# Altium schematic sheet CAN.SchDoc: Evaluation Board 3.2
size A3; Organization: Toradex AG; Address1: Altsagenstrasse 5; Address2: Horw; Address3: 6048; Address4: Switzerland; DocumentNumber: 19; Revision: V3.2; SheetNumber: 19; SheetTotal: 23; PageSetup: Record=PageOptions|CenterHorizontal=True|CenterVertical=True|PrintScale=0.73|XCorrection=1.00|YCorrection=1.00|PrintKind=0|BorderSize=5000000|LeftOffset=0|BottomOffset=0|Orientation=2|PaperLength=1000|PaperWidth=1000|Scale=100|PaperSource=7|PrintQuality=-4|MediaType=1|DitherType=10|PaperKind=A4|PrintScaleMode=1
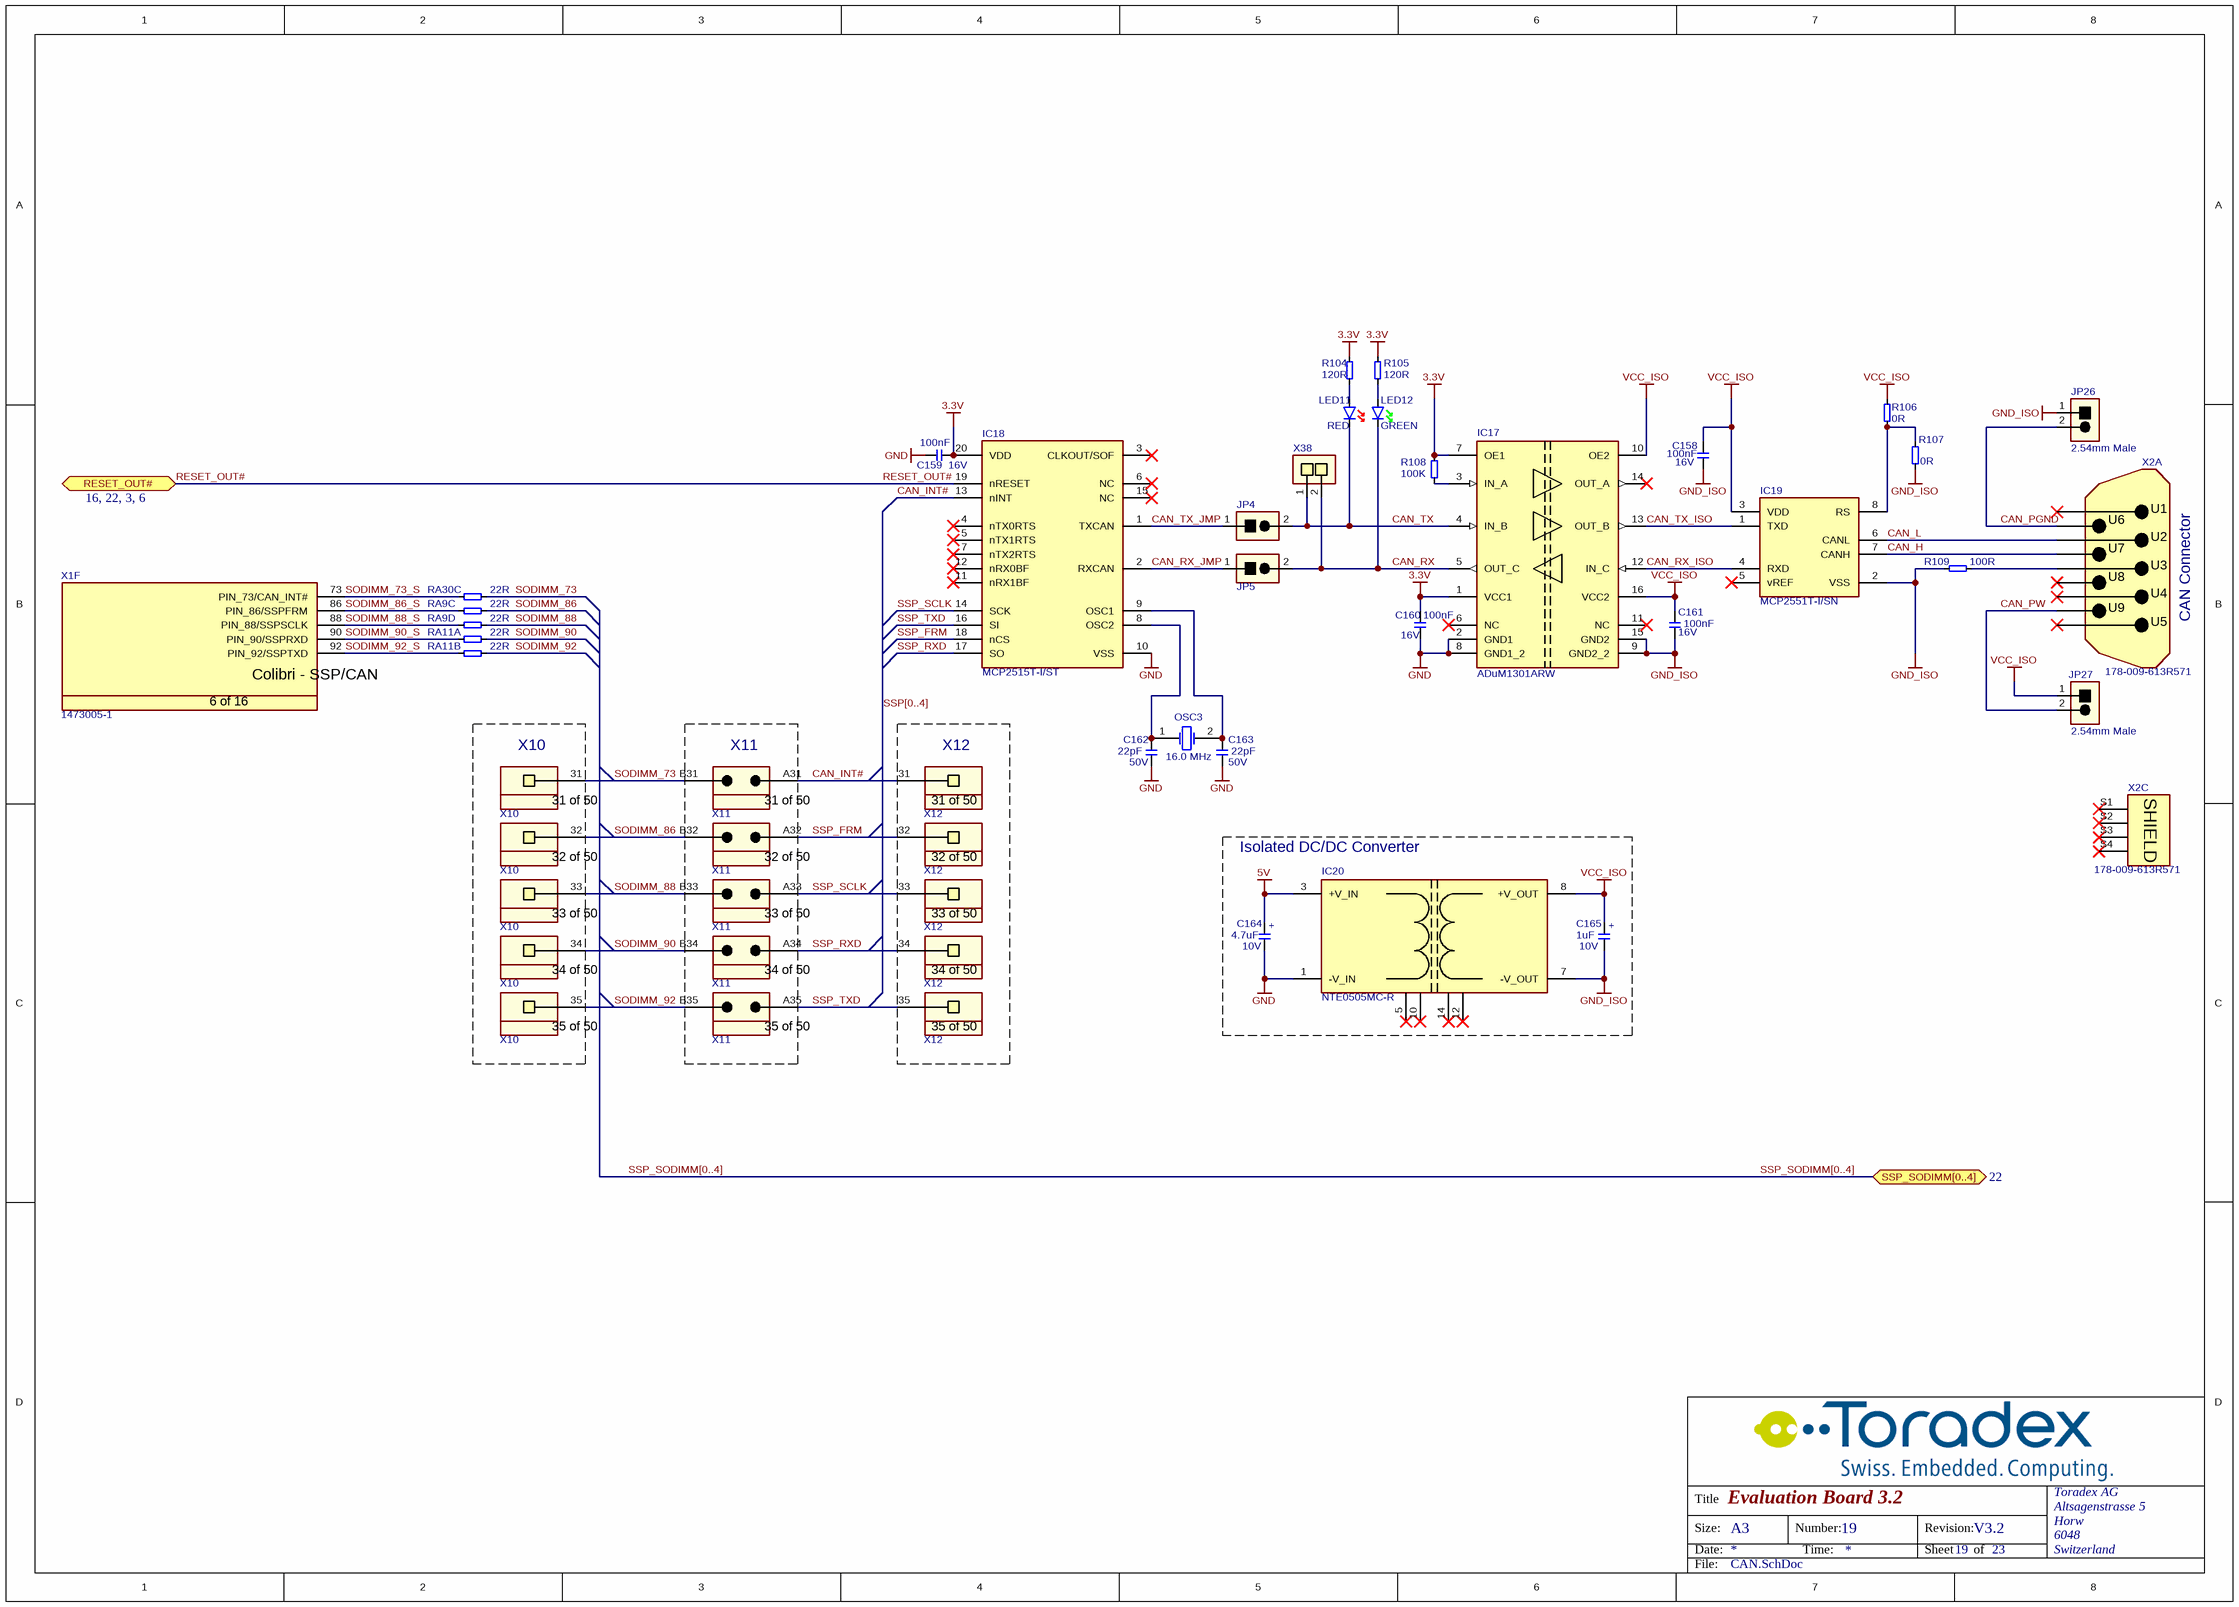
[diagram p0: CAN.SchDoc]

## Parts
C158  Rating: 16V  [T_CAPC0603X33N]  (hidden comment: 100nF)
C159  Rating: 16V  [T_CAPC0603X33N]  (hidden comment: 100nF)
C160  Rating: 16V  [T_CAPC0603X33N]  (hidden comment: 100nF)
C161  Rating: 16V  [T_CAPC0603X33N]  (hidden comment: 100nF)
C162  Rating: 50V  [T_CAPC0603X33N]  (hidden comment: 22pF)
C163  Rating: 50V  [T_CAPC0603X33N]  (hidden comment: 22pF)
C164  Rating: 10V  [T_CAPMP3216X180N]  (hidden comment: 4.7uF)
C165  Rating: 10V  [T_CAPMP3216X180N]  (hidden comment: 1uF)
IC17  ADuM1301ARW  [T_AD_ADuM1300ARW]
IC18  Manufacturer Part No.: MCP2515T-I/ST  [T_MC_MCP2515T-I/ST]  (hidden comment: MCP2515)
IC19  MCP2551T-I/SN  [SOIC127P600X173-8N]
IC20  NTE0505MC-R  [T_MURATA_NTE0505MC-R]
JP4  TSW-101-07-G-D  [T_Samtec_TSW-101-07-G-D]  (value not drawn)
JP5  TSW-101-07-G-D  [T_Samtec_TSW-101-07-G-D]  (value not drawn)
JP26  TSW-101-07-G-D  [T_Samtec_TSW-101-07-G-D]  (value not drawn)
JP27  TSW-101-07-G-D  [T_Samtec_TSW-101-07-G-D]  (value not drawn)
LED11  Color: RED  [T_Osram_T670_RED]  (hidden comment: LS T670-K1L2-1)
LED12  Color: GREEN  [T_Osram_T670_GREEN]  (hidden comment: LG T670-K1L2-1)
OSC3  value 16.0 MHz  [T_RAKON_12SMX]  (hidden comment: 12SMX (B) 30/5020/16)
R104  120R  [T_RESC0603X30N]
R105  120R  [T_RESC0603X30N]
R106  0R  [T_RESC0603X30N]
R107  0R  [T_RESC0603X30N]
R108  100K  [T_RESC0603X30N]
R109  100R  [T_RESC0603X30N]
RA9  22R  [T_Resistor_Array_X4]  (parts C,D of 4)
RA11  22R  [T_Resistor_Array_X4]  (parts A,B of 4)
RA30  22R  [T_Resistor_Array_X4]  (part C of 4)
X1  Manufacturer Part No.: 1473005-1  [T_Tyco_1473005-1]  (hidden comment: CON-Tyco-1473005-1-200-0.6mm)  (part F of 16)
X2  178-009-613R571  [T_NorComp_178-YYY-613R691]  (parts A,C of 3)
X10  SSW-110-01-G-S  [T_Samtec_SSW-110-01-G-S]  (value not drawn)  (parts 31,32,33,34,35 of 50)
X11  TSW-110-07-G-D  [T_Samtec_TSW-110-07-G-D]  (value not drawn)  (parts 31,32,33,34,35 of 50)
X12  SSW-110-01-G-S  [T_Samtec_SSW-110-01-G-S]  (value not drawn)  (parts 31,32,33,34,35 of 50)
X38  SSW-102-01-G-S  [T_Samtec_SSW-102-01-G-S]  (value not drawn)

## Blocks framed on the sheet
X10: X10
X11: X11
X12: X12
Isolated DC/DC Converter: C164 C165 IC20

## Ports
RESET_OUT# (bidir, see 16, 22, 3, 6), SSP_SODIMM[0..4] (bidir, see 22)

## Nets
3.3V: C159.1 C160.2 IC17.1(VCC1) IC17.7(OE1) IC18.20(VDD) R104.1 R105.1 R108.2
5V: C164.1 IC20.3(+V_IN)
GND: C159.2 C160.1 C162.1 C163.1 C164.2 IC17.2(GND1) IC17.8(GND1_2) IC18.10(VSS) IC20.1(-V_IN)
GND_ISO: C158.1 C161.1 C165.2 IC17.9(GND2_2) IC17.15(GND2) IC19.2(VSS) IC20.7(-V_OUT) JP26.1 R107.1 R109.2
VCC_ISO: C158.2 C161.2 C165.1 IC17.10(OE2) IC17.16(VCC2) IC19.3(VDD) IC20.8(+V_OUT) JP27.1 R106.2
CAN_H: IC19.7(CANH) X2.U7(RTS)
CAN_INT#: IC18.13(nINT) X11.A31 X12.31
CAN_L: IC19.6(CANL) X2.U2(RXD)
CAN_PGND: JP26.2 X2.U6(DSR)
CAN_PW: JP27.2 X2.U9(RI)
CAN_RX: IC17.5(OUT_C) JP5.2 LED12.K X38.2
CAN_RX_ISO: IC17.12(IN_C) IC19.4(RXD)
CAN_RX_JMP: IC18.2(RXCAN) JP5.1
CAN_TX: IC17.4(IN_B) JP4.2 LED11.K X38.1
CAN_TX_ISO: IC17.13(OUT_B) IC19.1(TXD)
CAN_TX_JMP: IC18.1(TXCAN) JP4.1
RESET_OUT#: IC18.19(nRESET) ; port RESET_OUT#
SODIMM_73: RA30.7 X10.31 X11.B31
SODIMM_73_S: RA30.3 X1.73(PIN_73/CAN_INT#)
SODIMM_86: RA9.7 X10.32 X11.B32
SODIMM_86_S: RA9.3 X1.86(PIN_86/SSPFRM)
SODIMM_88: RA9.8 X10.33 X11.B33
SODIMM_88_S: RA9.4 X1.88(PIN_88/SSPSCLK)
SODIMM_90: RA11.5 X10.34 X11.B34
SODIMM_90_S: RA11.1 X1.90(PIN_90/SSPRXD)
SODIMM_92: RA11.6 X10.35 X11.B35
SODIMM_92_S: RA11.2 X1.92(PIN_92/SSPTXD)
SSP_FRM: IC18.18(nCS) X11.A32 X12.32
SSP_RXD: IC18.17(SO) X11.A34 X12.34
SSP_SCLK: IC18.14(SCK) X11.A33 X12.33
SSP_TXD: IC18.16(SI) X11.A35 X12.35
NetC162_2: C162.2 IC18.8(OSC2) OSC3.1(OSC1)
NetC163_2: C163.2 IC18.9(OSC1) OSC3.2(OSC2)
NetIC17_3: IC17.3(IN_A) R108.1
NetIC19_8: IC19.8(RS) R106.1 R107.2
NetLED11_A: LED11.A R104.2
NetLED12_A: LED12.A R105.2
NetR109_1: R109.1 X2.U3(TXD)

Not connected (* = marked no-connect by the designer): IC17 6(NC)* 11(NC)* 14(OUT_A)*; IC18 3(CLKOUT/SOF)* 4(nTX0RTS)* 5(nTX1RTS)* 6(NC)* 7(nTX2RTS)* 11(nRX1BF)* 12(nRX0BF)* 15(NC)*; IC19 5(vREF)*; IC20 5(NC)* 10(NC)* 12(NC)* 14(NC)*; X2 S1(SHIELD)* S2(SHIELD)* S3(SHIELD)* S4(SHIELD)* U1(DCD)* U4(DTR)* U5(GND)* U8(CTS)*

## Buses and harness runs
bus SSP[0..4]
bus SSP_SODIMM[0..4] = port SSP_SODIMM[0..4]

## Notes on the sheet
- (near JP26) 2.54mm Male
- CAN Connector
- (near JP27) 2.54mm Male
- Title
- Size:
- Date:
- A3
- Number:
- Time:
- Revision:
- Sheet
- of
- File:
- (in symbol C-TA-1uF-10V-20%-3216) +
- (in symbol C-TA-4.7uF-10V-20%-3216) +
- (in symbol CON-Samtec-SSW-110-01-G-S, part 31) 31 of 50
- (in symbol CON-Samtec-SSW-110-01-G-S, part 32) 32 of 50
- (in symbol CON-Samtec-SSW-110-01-G-S, part 33) 33 of 50
- (in symbol CON-Samtec-SSW-110-01-G-S, part 34) 34 of 50
- (in symbol CON-Samtec-SSW-110-01-G-S, part 35) 35 of 50
- (in symbol CON-Samtec-TSW-110-07-G-D, part 31) 31 of 50
- (in symbol CON-Samtec-TSW-110-07-G-D, part 32) 32 of 50
- (in symbol CON-Samtec-TSW-110-07-G-D, part 33) 33 of 50
- (in symbol CON-Samtec-TSW-110-07-G-D, part 34) 34 of 50
- (in symbol CON-Samtec-TSW-110-07-G-D, part 35) 35 of 50
- (in symbol CON-Tyco-1473005-1-200-0.6mm, part F) Colibri - SSP/CAN; 6 of 16

## Library data of the parts
C158-C161 = C-X7R-100nF-16V-10%-0603: Capacitor Ceramic X7R 100nF 16V 10% 0603; Tolerance: 10%; Type: X7R; Value: 100nF
C162 C163 = C-NPO-22pF-50V-5%-0603: Capacitor Ceramic NPO 22pF 50V 5% 0603; Tolerance: 5%; Type: NPO; Value: 22pF
C164 = C-TA-4.7uF-10V-20%-3216: Capacitor TA 4.7uF 10V 20% 3216; Tolerance: 20%; Type: TA; Value: 4.7uF
C165 = C-TA-1uF-10V-20%-3216: Capacitor TA 1uF 10V 20% 3216; Tolerance: 20%; Type: TA; Value: 1uF
IC17 = IC-AD-ADuM1301ARW: Digital Isolator; Manufacturer Name: Analog Devices; Manufacturer Part No.: ADuM1301ARW
IC18 = IC-MC-MCP2515T-I/ST: CAN controller with SPI Interface; Manufacturer Name: Microchip
IC19 = IC-MC-MCP2551T-I/SN: High speed CAN Transceiver; Manufacturer Name: Microchip; Manufacturer Part No.: MCP2551T-I/SN
IC20 = IC-MUR-NTE0505MC-R: Isolated DC/DC Converter; Manufacturer Name: Murata; Manufacturer Part No.: NTE0505MC-R
JP4 JP5 = CON-Samtec-TSW-101-07-G-D_1: Header male, 1x2 Pins, 2.54 mm pitch; Manufacturer Name: Samtec; Pitch: 2.54 mm; No. of ways: 1x2; Manufacturer Part no.: TSW-101-07-G-D
JP26 JP27 = CON-Samtec-TSW-101-07-G-D: Header male, 1x2 Pins, 2.54 mm pitch; Manufacturer Name: Samtec; Pitch: 2.54 mm; No. of ways: 1x2; Manufacturer Part no.: TSW-101-07-G-D
LED11 = LED-Osram-LS T670-K1L2-1: LED red, Osram LS T670-K1L2-1; Manufacturer Part N.: LS T670-K1L2-1; Manufacturer Name: Osram
LED12 = LED-Osram-T670-K1L2-1: LED green Osram LG T670-K1L2-1; Manufacturer Part N.: LG T670-K1L2-1; Manufacturer Name: Osram
OSC3 = OSC-RAKON-12SMX (B) 30/5020/16-16.0 MHz-30ppm-7.5x5.2mm: Quartz 16.0 MHz; Manufacturer Name: RAKON; Tolerance: 30ppm; Manufacturer Part No.: 12SMX (B) 30/5020/16
R104 R105 = R-120R-63mW-5%-0603: Resistor 120 ohm 63mW 5% 0603; Rating: 63mW; Tolerance: 5%; Value: 120R
R106 R107 = R-0R-63mW-1%-0603: Resistor 0 ohm 63mW 1% 0603; Rating: 63mW; Tolerance: 1%; Value: 0R
R108 = R-100KR-63mW-5%-0603: Resistor 100 Kohm 63mW 5% 0603; Value: 100KR; Rating: 63mW; Tolerance: 5%
R109 = R-100R-63mW-5%-0603: Resistor 100 ohm 63mW 5% 0603; Rating: 63mW; Tolerance: 5%; Value: 100R
RA9 RA11 RA30 = RA-22R-63mW-5%-1206-div: Resistor Array 22 R 63mW 5% 1206; Tolerance: 5%; Power Dissipation: 63mW; Value: 22R
X1 = CON-Tyco-1473005-1-200-0.6mm: SODIMM Connector; Manufacturer Name: Tyco; No. of ways: 200
X2 = CON-NorComp-178-009-613R571: RS232 Connector 9 pins male; No. of Ways: 18; Manufacturer Name: NorComp; Manufacturer Part No.: 178-009-613R571
X10 X12 = CON-Samtec-SSW-110-01-G-S: Header 1x50 pin 2.54mm pitch; Manufacturer Name: Samtec; Pitch: 2.54mm; No. of ways: 1x50; Manufacturer Part No.: SSW-110-01-G-S
X11 = CON-Samtec-TSW-110-07-G-D: Header 2x50 pin 2.54mm pitch; Manufacturer Name: Samtec; Pitch: 2.54mm; No. of ways: 2x50; Manufacturer Part No.: TSW-110-07-G-D
X38 = CON-Samtec-SSW-102-01-G-S: Receptacle Female, 1x2 Pins, 2.54 mm pitch; Manufacturer Name: Samtec; Pitch: 2.54 mm; No. of ways: 1x2; Manufacturer Part no.: SSW-102-01-G-S